# Altium schematic sheet ARM.SchDoc: Animated Archer Main PCB
size Letter; Author: John Eric Martin; Engineer: John Eric Martin; Organization: UCCS IEEE Robotics; Address1: 1420 Austin Bluffs Pkwy; Address2: Colorado Springs, CO 80918; DocumentNumber: ARM1; Revision: 1; SheetNumber: 1; SheetTotal: 10; ProjectName: Animated Archer Quadcopter
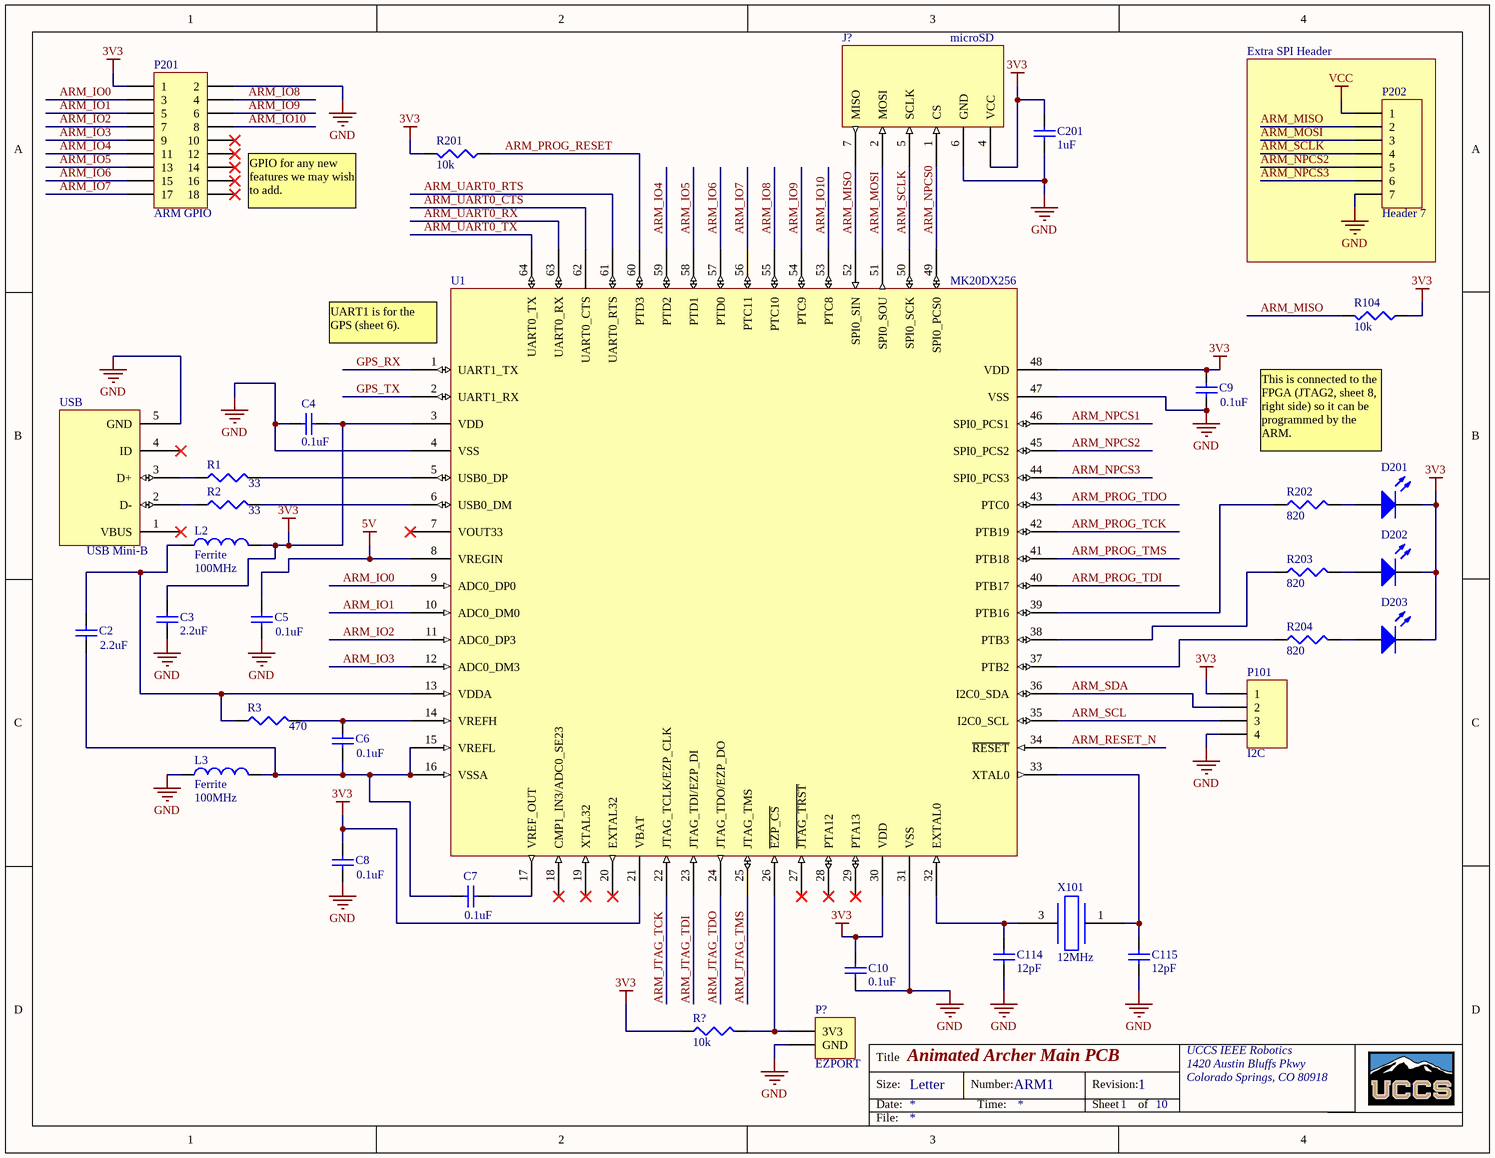
[diagram p0: ARM.SchDoc]

## Parts
C2  value 2.2uF  [C0805]  (hidden comment: Cap Semi)
C3  value 2.2uF  [C0805]  (hidden comment: Cap Semi)
C4  value 0.1uF  [C0805]  (hidden comment: Cap Semi)
C5  value 0.1uF  [C0805]  (hidden comment: Cap Semi)
C6  value 0.1uF  [C0805]  (hidden comment: Cap Semi)
C7  value 0.1uF  [C0805]  (hidden comment: Cap Semi)
C8  value 0.1uF  [C0805]  (hidden comment: Cap Semi)
C9  value 0.1uF  [C0805]  (hidden comment: Cap Semi)
C10  value 0.1uF  [C0805]  (hidden comment: Cap Semi)
C114  value 12pF  [1608[0603]]  (hidden comment: 0.1uF)
C115  value 12pF  [1608[0603]]  (hidden comment: 0.1uF)
C201  value 1uF  [1608[0603]]  (hidden comment: 0.1uF)
D201  Green  [1608[0603]]  (value not drawn)
D202  Green  [1608[0603]]  (value not drawn)
D203  Green  [1608[0603]]  (value not drawn)
J?  microSD  [500873-0806]
L2  Ferrite  value 100MHz  [C0805]
L3  Ferrite  value 100MHz  [C0805]
P101  I2C  [HDR1X4]
P201  ARM GPIO  [HDR2X9]
P202  Header 7  [HDR1X7]
P?  EZPORT  [HDR1X2]
R1  value 33  [6-0805_N]  (hidden comment: Res3)
R2  value 33  [6-0805_N]  (hidden comment: Res3)
R3  value 470  [6-0805_N]  (hidden comment: Res3)
R104  value 10k  [J1-0603]  (hidden comment: Res3)
R201  value 10k  [J1-0603]  (hidden comment: Res3)
R202  value 820  [J1-0603]  (hidden comment: Res3)
R203  value 820  [J1-0603]  (hidden comment: Res3)
R204  value 820  [J1-0603]  (hidden comment: Res3)
R?  value 10k  [J1-0603]  (hidden comment: Res3)
U1  Part Number: MK20DX256  [MK20DX128VLH5]  (hidden comment: MK20DX128VLH5)
USB  USB Mini-B  [54819-0572]
X101  12MHz  [CTS405XTAL]

## Blocks framed on the sheet
Extra SPI Header: P202

## Nets
3V3: C3.2 C4.1 C8.2 C9.2 C10.2 C201.1 D201.2(K) D202.2(K) D203.2(K) J?.4(VCC) L2.2 P101.1 P201.1 R104.1 R201.1 R?.1 U1.3(VDD) U1.21(VBAT) U1.30(VDD) U1.48(VDD)
5V: C5.2 U1.8(VREGIN)
GND: C3.1 C4.2 C5.1 C8.1 C9.1 C10.1 C114.1 C115.1 C201.2 J?.6(GND) L3.1 P101.4 P201.2 P202.7 P?.2(GND) U1.4(VSS) U1.31(VSS) U1.47(VSS) USB.5(GND)
VCC: P202.1
ARM_IO0: P201.3 U1.9(ADC0_DP0)
ARM_IO1: P201.5 U1.10(ADC0_DM0)
ARM_IO2: P201.7 U1.11(ADC0_DP3)
ARM_IO3: P201.9 U1.12(ADC0_DM3)
ARM_IO4: P201.11 U1.59(PTD2)
ARM_IO5: P201.13 U1.58(PTD1)
ARM_IO6: P201.15 U1.57(PTD0)
ARM_IO7: P201.17 U1.56(PTC11)
ARM_IO8: P201.4 U1.55(PTC10)
ARM_IO9: P201.6 U1.54(PTC9)
ARM_IO10: P201.8 U1.53(PTC8)
ARM_JTAG_TCK: U1.22(JTAG_TCLK/EZP_CLK)
ARM_JTAG_TDI: U1.23(JTAG_TDI/EZP_DI)
ARM_JTAG_TDO: U1.24(JTAG_TDO/EZP_DO)
ARM_JTAG_TMS: U1.25(JTAG_TMS)
ARM_MISO: J?.7(MISO) P202.2 R104.2 U1.52(SPI0_SIN)
ARM_MOSI: J?.2(MOSI) P202.3 U1.51(SPI0_SOU)
ARM_NPCS0: J?.1(CS) U1.49(SPI0_PCS0)
ARM_NPCS1: U1.46(SPI0_PCS1)
ARM_NPCS2: P202.5 U1.45(SPI0_PCS2)
ARM_NPCS3: P202.6 U1.44(SPI0_PCS3)
ARM_PROG_RESET: R201.2 U1.60(PTD3)
ARM_PROG_TCK: U1.42(PTB19)
ARM_PROG_TDI: U1.40(PTB17)
ARM_PROG_TDO: U1.43(PTC0)
ARM_PROG_TMS: U1.41(PTB18)
ARM_RESET_N: U1.34(~{RESET})
ARM_SCL: P101.3 U1.35(I2C0_SCL)
ARM_SCLK: J?.5(SCLK) P202.4 U1.50(SPI0_SCK)
ARM_SDA: P101.2 U1.36(I2C0_SDA)
ARM_UART0_CTS: U1.62(UART0_CTS)
ARM_UART0_RTS: U1.61(UART0_RTS)
ARM_UART0_RX: U1.63(UART0_RX)
ARM_UART0_TX: U1.64(UART0_TX)
GPS_RX: U1.1(UART1_TX)
GPS_TX: U1.2(UART1_RX)
NetC2_1: C2.1 C6.1 C7.2 L3.2 U1.15(VREFL) U1.16(VSSA)
NetC2_2: C2.2 L2.1 R3.1 U1.13(VDDA)
NetC6_2: C6.2 R3.2 U1.14(VREFH)
NetC7_1: C7.1 U1.17(VREF_OUT)
NetC114_2: C114.2 U1.32(EXTAL0) X101.3
NetC115_2: C115.2 U1.33(XTAL0) X101.1
NetD201_1: D201.1(A) R202.2
NetD202_1: D202.1(A) R203.2
NetD203_1: D203.1(A) R204.2
NetP?_1: P?.1(3V3) R?.2 U1.26(~{EZP_CS})
NetR1_1: R1.1 USB.3(D+)
NetR1_2: R1.2 U1.5(USB0_DP)
NetR2_1: R2.1 USB.2(D-)
NetR2_2: R2.2 U1.6(USB0_DM)
NetR202_1: R202.1 U1.39(PTB16)
NetR203_1: R203.1 U1.38(PTB3)
NetR204_1: R204.1 U1.37(PTB2)

Not connected (* = marked no-connect by the designer): P201 10* 12* 14* 16* 18*; U1 7(VOUT33)* 18(CMP1_IN3/ADC0_SE23)* 19(XTAL32)* 20(EXTAL32)* 27(~{JTAG_TRST})* 28(PTA12)* 29(PTA13)*; USB 1(VBUS)* 4(ID)* 6(CASE)

## Notes on the sheet
- (near P201) GPIO for any new features we may wish to add.
- (near U1) UART1 is for the GPS (sheet 6).
- This is connected to the FPGA (JTAG2, sheet 8, right side) so it can be programmed by the ARM.
- Title
- Size:
- Date:
- Letter
- Number:
- Time:
- Revision:
- Sheet
- of
- File:

## Library data of the parts
C2-C10 C114 C115 C201 = Cap Semi: Capacitor (Semiconductor SIM Model); Published: 8-Jun-2000; LatestRevisionDate: 29-May-2009; LatestRevisionNote: IPC-7351 Footprint Added.; PackageReference: C1206; Publisher: Altium Limited; PackageDescription: Chip Capacitor
D201-D203 = LED2: Typical RED, GREEN, YELLOW, AMBER GaAs LED; Published: 8-Jun-2000; LatestRevisionDate: 17-Jul-2002; LatestRevisionNote: Re-released for DXP Platform.; PackageVersion: Feb-2002; PackageReference: 3.2X1.6X1.1; Publisher: Altium Limited; PackageDescription: SM LED; 2 Flat Leads
J? = 500873-0806: microSD Memory Card Connector
L2 L3 = Inductor: Code_IEC: 1005; Published: 8-Jun-2000; LatestRevisionDate: 29-May-2009; LatestRevisionNote: IPC-7351 Footprint Added.; PackageReference: 0402-A; Publisher: Altium Limited; PackageDescription: Chip Inductor; Code_JEITA: 0402
P101 = Header 4: Header, 4-Pin; LatestRevisionDate: 17-Jul-2002; LatestRevisionNote: Re-released for DXP Platform.; Publisher: Altium Limited
P201 = Header 9X2: Header, 9-Pin, Dual row; LatestRevisionDate: 17-Jul-2002; LatestRevisionNote: Re-released for DXP Platform.; Publisher: Altium Limited
P202 = Header 7: Header, 7-Pin; LatestRevisionDate: 17-Jul-2002; LatestRevisionNote: Re-released for DXP Platform.; Publisher: Altium Limited
P? = Header 2: Header, 2-Pin; LatestRevisionDate: 17-Jul-2002; LatestRevisionNote: Re-released for DXP Platform.; Publisher: Altium Limited
R1-R3 R104 R201-R204 R? = Res3: Resistor; Published: 8-Jun-2000; LatestRevisionDate: 29-May-2009; LatestRevisionNote: IPC-7351 Footprint Added.; PackageReference: J1-0603; Publisher: Altium Limited; PackageDescription: Chip Resistor
U1 = MK20DX128VLH5: Freescale ARM Cortex-M4; Supplier 1: Digi-Key; Supplier 2: Newark; Supplier 3: Mouser; Supplier Part Number 1: MK20DX128VLH5-ND; Supplier Part Number 2: 24W6502; Supplier Part Number 3: 841-MK20DX128VLH5
USB = USB Mini-B: 54819-0572
X101 = CTS405XTAL: CTS 405 Surface Mount Quartz Crystal (405C35B12M00000); Supplier 1: Mouser; Supplier 2: Digi-Key; Supplier 3: Digi-Key; Supplier 4: Arrow; Supplier 5: Digi-Key